# EAGLE schematic vga_controller (EAGLE 9.6.2)
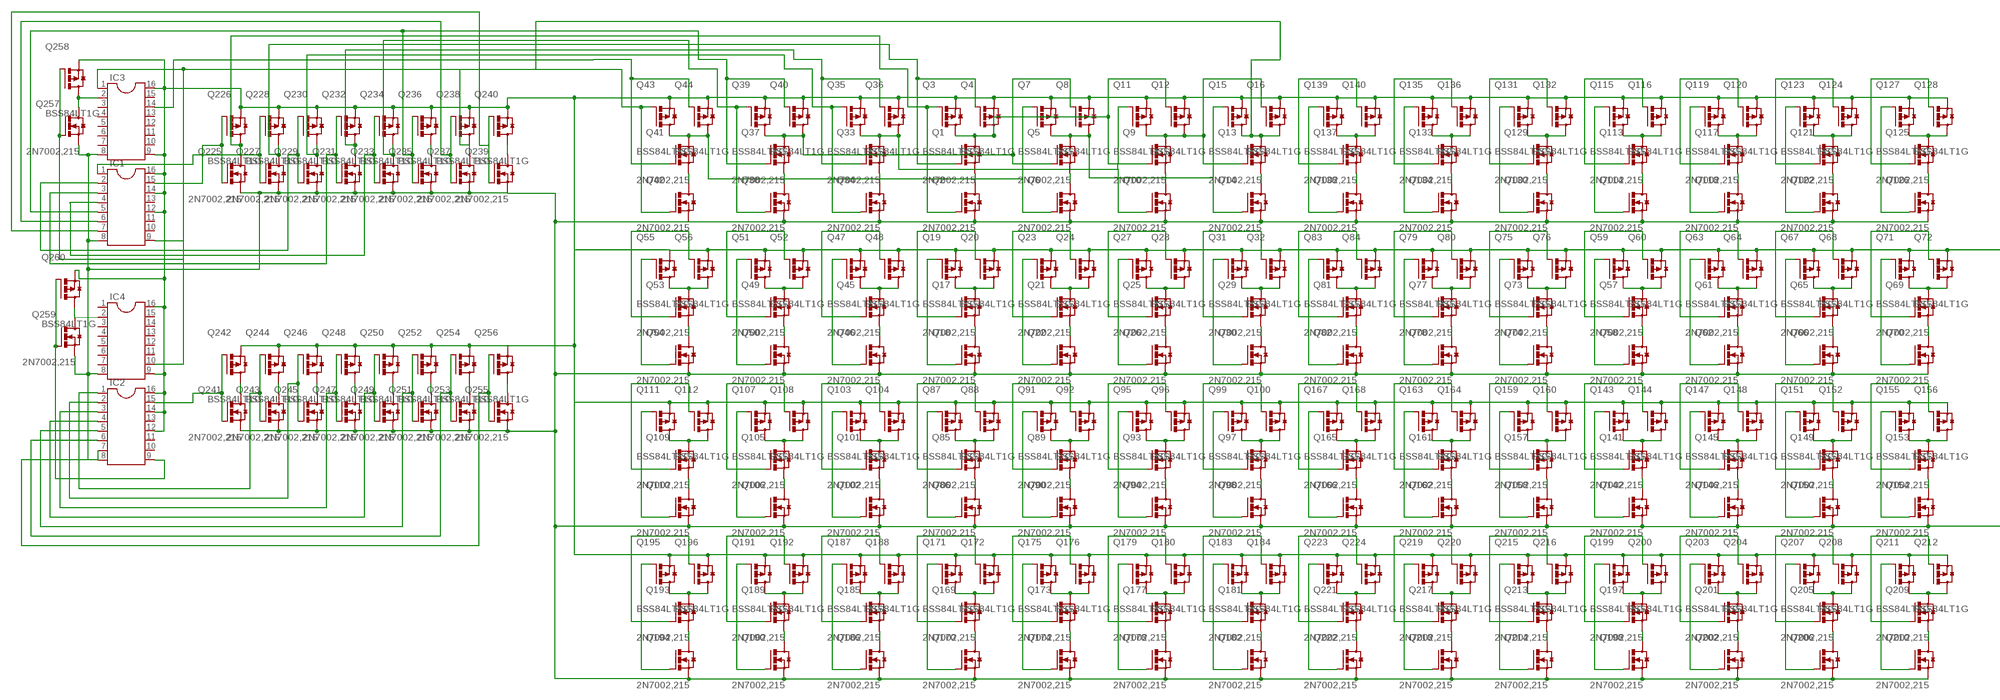
[diagram p0: schematic, sheet 1, part 1 of 2]
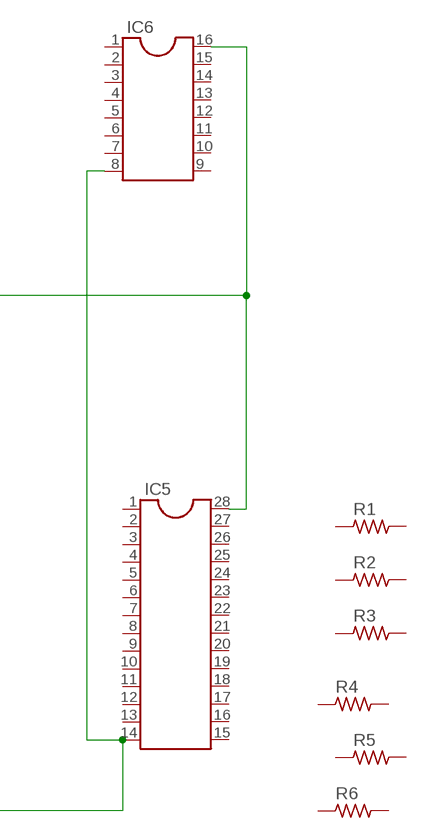
[diagram p1: schematic, sheet 1, part 2 of 2]

## Parts
IC1  DIL16S  [SOCKET-16]
IC2  DIL16S  [SOCKET-16]
IC3  DIL16S  [SOCKET-16]
IC4  DIL16S  [SOCKET-16]
IC5  DIL28-3  [DIL28-3]
IC6  DIL16S  [SOCKET-16]
Q1  2N7002,215  [SOT23-3]
Q2  2N7002,215  [SOT23-3]
Q3  BSS84LT1G  [SOT23-3]
Q4  BSS84LT1G  [SOT23-3]
Q5  2N7002,215  [SOT23-3]
Q6  2N7002,215  [SOT23-3]
Q7  BSS84LT1G  [SOT23-3]
Q8  BSS84LT1G  [SOT23-3]
Q9  2N7002,215  [SOT23-3]
Q10  2N7002,215  [SOT23-3]
Q11  BSS84LT1G  [SOT23-3]
Q12  BSS84LT1G  [SOT23-3]
Q13  2N7002,215  [SOT23-3]
Q14  2N7002,215  [SOT23-3]
Q15  BSS84LT1G  [SOT23-3]
Q16  BSS84LT1G  [SOT23-3]
Q17  2N7002,215  [SOT23-3]
Q18  2N7002,215  [SOT23-3]
Q19  BSS84LT1G  [SOT23-3]
Q20  BSS84LT1G  [SOT23-3]
Q21  2N7002,215  [SOT23-3]
Q22  2N7002,215  [SOT23-3]
Q23  BSS84LT1G  [SOT23-3]
Q24  BSS84LT1G  [SOT23-3]
Q25  2N7002,215  [SOT23-3]
Q26  2N7002,215  [SOT23-3]
Q27  BSS84LT1G  [SOT23-3]
Q28  BSS84LT1G  [SOT23-3]
Q29  2N7002,215  [SOT23-3]
Q30  2N7002,215  [SOT23-3]
Q31  BSS84LT1G  [SOT23-3]
Q32  BSS84LT1G  [SOT23-3]
Q33  2N7002,215  [SOT23-3]
Q34  2N7002,215  [SOT23-3]
Q35  BSS84LT1G  [SOT23-3]
Q36  BSS84LT1G  [SOT23-3]
Q37  2N7002,215  [SOT23-3]
Q38  2N7002,215  [SOT23-3]
Q39  BSS84LT1G  [SOT23-3]
Q40  BSS84LT1G  [SOT23-3]
Q41  2N7002,215  [SOT23-3]
Q42  2N7002,215  [SOT23-3]
Q43  BSS84LT1G  [SOT23-3]
Q44  BSS84LT1G  [SOT23-3]
Q45  2N7002,215  [SOT23-3]
Q46  2N7002,215  [SOT23-3]
Q47  BSS84LT1G  [SOT23-3]
Q48  BSS84LT1G  [SOT23-3]
Q49  2N7002,215  [SOT23-3]
Q50  2N7002,215  [SOT23-3]
Q51  BSS84LT1G  [SOT23-3]
Q52  BSS84LT1G  [SOT23-3]
Q53  2N7002,215  [SOT23-3]
Q54  2N7002,215  [SOT23-3]
Q55  BSS84LT1G  [SOT23-3]
Q56  BSS84LT1G  [SOT23-3]
Q57  2N7002,215  [SOT23-3]
Q58  2N7002,215  [SOT23-3]
Q59  BSS84LT1G  [SOT23-3]
Q60  BSS84LT1G  [SOT23-3]
Q61  2N7002,215  [SOT23-3]
Q62  2N7002,215  [SOT23-3]
Q63  BSS84LT1G  [SOT23-3]
Q64  BSS84LT1G  [SOT23-3]
Q65  2N7002,215  [SOT23-3]
Q66  2N7002,215  [SOT23-3]
Q67  BSS84LT1G  [SOT23-3]
Q68  BSS84LT1G  [SOT23-3]
Q69  2N7002,215  [SOT23-3]
Q70  2N7002,215  [SOT23-3]
Q71  BSS84LT1G  [SOT23-3]
Q72  BSS84LT1G  [SOT23-3]
Q73  2N7002,215  [SOT23-3]
Q74  2N7002,215  [SOT23-3]
Q75  BSS84LT1G  [SOT23-3]
Q76  BSS84LT1G  [SOT23-3]
Q77  2N7002,215  [SOT23-3]
Q78  2N7002,215  [SOT23-3]
Q79  BSS84LT1G  [SOT23-3]
Q80  BSS84LT1G  [SOT23-3]
Q81  2N7002,215  [SOT23-3]
Q82  2N7002,215  [SOT23-3]
Q83  BSS84LT1G  [SOT23-3]
Q84  BSS84LT1G  [SOT23-3]
Q85  2N7002,215  [SOT23-3]
Q86  2N7002,215  [SOT23-3]
Q87  BSS84LT1G  [SOT23-3]
Q88  BSS84LT1G  [SOT23-3]
Q89  2N7002,215  [SOT23-3]
Q90  2N7002,215  [SOT23-3]
Q91  BSS84LT1G  [SOT23-3]
Q92  BSS84LT1G  [SOT23-3]
Q93  2N7002,215  [SOT23-3]
Q94  2N7002,215  [SOT23-3]
Q95  BSS84LT1G  [SOT23-3]
Q96  BSS84LT1G  [SOT23-3]
Q97  2N7002,215  [SOT23-3]
Q98  2N7002,215  [SOT23-3]
Q99  BSS84LT1G  [SOT23-3]
Q100  BSS84LT1G  [SOT23-3]
Q101  2N7002,215  [SOT23-3]
Q102  2N7002,215  [SOT23-3]
Q103  BSS84LT1G  [SOT23-3]
Q104  BSS84LT1G  [SOT23-3]
Q105  2N7002,215  [SOT23-3]
Q106  2N7002,215  [SOT23-3]
Q107  BSS84LT1G  [SOT23-3]
Q108  BSS84LT1G  [SOT23-3]
Q109  2N7002,215  [SOT23-3]
Q110  2N7002,215  [SOT23-3]
Q111  BSS84LT1G  [SOT23-3]
Q112  BSS84LT1G  [SOT23-3]
Q113  2N7002,215  [SOT23-3]
Q114  2N7002,215  [SOT23-3]
Q115  BSS84LT1G  [SOT23-3]
Q116  BSS84LT1G  [SOT23-3]
Q117  2N7002,215  [SOT23-3]
Q118  2N7002,215  [SOT23-3]
Q119  BSS84LT1G  [SOT23-3]
Q120  BSS84LT1G  [SOT23-3]
Q121  2N7002,215  [SOT23-3]
Q122  2N7002,215  [SOT23-3]
Q123  BSS84LT1G  [SOT23-3]
Q124  BSS84LT1G  [SOT23-3]
Q125  2N7002,215  [SOT23-3]
Q126  2N7002,215  [SOT23-3]
Q127  BSS84LT1G  [SOT23-3]
Q128  BSS84LT1G  [SOT23-3]
Q129  2N7002,215  [SOT23-3]
Q130  2N7002,215  [SOT23-3]
Q131  BSS84LT1G  [SOT23-3]
Q132  BSS84LT1G  [SOT23-3]
Q133  2N7002,215  [SOT23-3]
Q134  2N7002,215  [SOT23-3]
Q135  BSS84LT1G  [SOT23-3]
Q136  BSS84LT1G  [SOT23-3]
Q137  2N7002,215  [SOT23-3]
Q138  2N7002,215  [SOT23-3]
Q139  BSS84LT1G  [SOT23-3]
Q140  BSS84LT1G  [SOT23-3]
Q141  2N7002,215  [SOT23-3]
Q142  2N7002,215  [SOT23-3]
Q143  BSS84LT1G  [SOT23-3]
Q144  BSS84LT1G  [SOT23-3]
Q145  2N7002,215  [SOT23-3]
Q146  2N7002,215  [SOT23-3]
Q147  BSS84LT1G  [SOT23-3]
Q148  BSS84LT1G  [SOT23-3]
Q149  2N7002,215  [SOT23-3]
Q150  2N7002,215  [SOT23-3]
Q151  BSS84LT1G  [SOT23-3]
Q152  BSS84LT1G  [SOT23-3]
Q153  2N7002,215  [SOT23-3]
Q154  2N7002,215  [SOT23-3]
Q155  BSS84LT1G  [SOT23-3]
Q156  BSS84LT1G  [SOT23-3]
Q157  2N7002,215  [SOT23-3]
Q158  2N7002,215  [SOT23-3]
Q159  BSS84LT1G  [SOT23-3]
Q160  BSS84LT1G  [SOT23-3]
Q161  2N7002,215  [SOT23-3]
Q162  2N7002,215  [SOT23-3]
Q163  BSS84LT1G  [SOT23-3]
Q164  BSS84LT1G  [SOT23-3]
Q165  2N7002,215  [SOT23-3]
Q166  2N7002,215  [SOT23-3]
Q167  BSS84LT1G  [SOT23-3]
Q168  BSS84LT1G  [SOT23-3]
Q169  2N7002,215  [SOT23-3]
Q170  2N7002,215  [SOT23-3]
Q171  BSS84LT1G  [SOT23-3]
Q172  BSS84LT1G  [SOT23-3]
Q173  2N7002,215  [SOT23-3]
Q174  2N7002,215  [SOT23-3]
Q175  BSS84LT1G  [SOT23-3]
Q176  BSS84LT1G  [SOT23-3]
Q177  2N7002,215  [SOT23-3]
Q178  2N7002,215  [SOT23-3]
Q179  BSS84LT1G  [SOT23-3]
Q180  BSS84LT1G  [SOT23-3]
Q181  2N7002,215  [SOT23-3]
Q182  2N7002,215  [SOT23-3]
Q183  BSS84LT1G  [SOT23-3]
Q184  BSS84LT1G  [SOT23-3]
Q185  2N7002,215  [SOT23-3]
Q186  2N7002,215  [SOT23-3]
Q187  BSS84LT1G  [SOT23-3]
Q188  BSS84LT1G  [SOT23-3]
Q189  2N7002,215  [SOT23-3]
Q190  2N7002,215  [SOT23-3]
Q191  BSS84LT1G  [SOT23-3]
Q192  BSS84LT1G  [SOT23-3]
Q193  2N7002,215  [SOT23-3]
Q194  2N7002,215  [SOT23-3]
Q195  BSS84LT1G  [SOT23-3]
Q196  BSS84LT1G  [SOT23-3]
Q197  2N7002,215  [SOT23-3]
Q198  2N7002,215  [SOT23-3]
Q199  BSS84LT1G  [SOT23-3]
Q200  BSS84LT1G  [SOT23-3]
Q201  2N7002,215  [SOT23-3]
Q202  2N7002,215  [SOT23-3]
Q203  BSS84LT1G  [SOT23-3]
Q204  BSS84LT1G  [SOT23-3]
Q205  2N7002,215  [SOT23-3]
Q206  2N7002,215  [SOT23-3]
Q207  BSS84LT1G  [SOT23-3]
Q208  BSS84LT1G  [SOT23-3]
Q209  2N7002,215  [SOT23-3]
Q210  2N7002,215  [SOT23-3]
Q211  BSS84LT1G  [SOT23-3]
Q212  BSS84LT1G  [SOT23-3]
Q213  2N7002,215  [SOT23-3]
Q214  2N7002,215  [SOT23-3]
Q215  BSS84LT1G  [SOT23-3]
Q216  BSS84LT1G  [SOT23-3]
Q217  2N7002,215  [SOT23-3]
Q218  2N7002,215  [SOT23-3]
Q219  BSS84LT1G  [SOT23-3]
Q220  BSS84LT1G  [SOT23-3]
Q221  2N7002,215  [SOT23-3]
Q222  2N7002,215  [SOT23-3]
Q223  BSS84LT1G  [SOT23-3]
Q224  BSS84LT1G  [SOT23-3]
Q225  2N7002,215  [SOT23-3]
Q226  BSS84LT1G  [SOT23-3]
Q227  2N7002,215  [SOT23-3]
Q228  BSS84LT1G  [SOT23-3]
Q229  2N7002,215  [SOT23-3]
Q230  BSS84LT1G  [SOT23-3]
Q231  2N7002,215  [SOT23-3]
Q232  BSS84LT1G  [SOT23-3]
Q233  2N7002,215  [SOT23-3]
Q234  BSS84LT1G  [SOT23-3]
Q235  2N7002,215  [SOT23-3]
Q236  BSS84LT1G  [SOT23-3]
Q237  2N7002,215  [SOT23-3]
Q238  BSS84LT1G  [SOT23-3]
Q239  2N7002,215  [SOT23-3]
Q240  BSS84LT1G  [SOT23-3]
Q241  2N7002,215  [SOT23-3]
Q242  BSS84LT1G  [SOT23-3]
Q243  2N7002,215  [SOT23-3]
Q244  BSS84LT1G  [SOT23-3]
Q245  2N7002,215  [SOT23-3]
Q246  BSS84LT1G  [SOT23-3]
Q247  2N7002,215  [SOT23-3]
Q248  BSS84LT1G  [SOT23-3]
Q249  2N7002,215  [SOT23-3]
Q250  BSS84LT1G  [SOT23-3]
Q251  2N7002,215  [SOT23-3]
Q252  BSS84LT1G  [SOT23-3]
Q253  2N7002,215  [SOT23-3]
Q254  BSS84LT1G  [SOT23-3]
Q255  2N7002,215  [SOT23-3]
Q256  BSS84LT1G  [SOT23-3]
Q257  2N7002,215  [SOT23-3]
Q258  BSS84LT1G  [SOT23-3]
Q259  2N7002,215  [SOT23-3]
Q260  BSS84LT1G  [SOT23-3]
R1  RC-MASTER-SMD_R_0603MP  [RC-MASTER-SMD_R0603MP]
R2  RC-MASTER-SMD_R_0603MP  [RC-MASTER-SMD_R0603MP]
R3  RC-MASTER-SMD_R_0603MP  [RC-MASTER-SMD_R0603MP]
R4  RC-MASTER-SMD_R_0603MP  [RC-MASTER-SMD_R0603MP]
R5  RC-MASTER-SMD_R_0603MP  [RC-MASTER-SMD_R0603MP]
R6  RC-MASTER-SMD_R_0603MP  [RC-MASTER-SMD_R0603MP]

## Nets
N$1: Q1.3(D) Q3.3(D) Q4.3(D) Q9.1(G) Q12.1(G)
N$2: Q1.2(S) Q2.3(D)
N$3: Q17.3(D) Q19.3(D) Q20.3(D)
N$4: IC3.1 IC4.10 Q13.3(D) Q15.3(D) Q16.3(D)
N$5: Q17.2(S) Q18.3(D)
N$6: Q5.3(D) Q7.3(D) Q8.3(D) Q14.1(G) Q15.1(G)
N$7: Q5.2(S) Q6.3(D)
N$8: Q18.1(G) Q19.1(G)
N$10: IC1.12 IC1.14 IC1.16 IC2.12 IC2.14 IC2.16 IC3.9 IC3.16 IC4.9 IC4.16 IC5.28 IC6.16 Q3.2(S) Q4.2(S) Q7.2(S) Q8.2(S) Q11.2(S) Q12.2(S) Q15.2(S) Q16.2(S) Q19.2(S) Q20.2(S) Q23.2(S) Q24.2(S) Q27.2(S) Q28.2(S) Q31.2(S) Q32.2(S) Q35.2(S) Q36.2(S) Q39.2(S) Q40.2(S) Q43.2(S) Q44.2(S) Q47.2(S) Q48.2(S) Q51.2(S) Q52.2(S) Q55.2(S) Q56.2(S) Q59.2(S) Q60.2(S) Q63.2(S) Q64.2(S) Q67.2(S) Q68.2(S) Q71.2(S) Q72.2(S) Q75.2(S) Q76.2(S) Q79.2(S) Q80.2(S) Q83.2(S) Q84.2(S) Q87.2(S) Q88.2(S) Q91.2(S) Q92.2(S) Q95.2(S) Q96.2(S) Q99.2(S) Q100.2(S) Q103.2(S) Q104.2(S) Q107.2(S) Q108.2(S) Q111.2(S) Q112.2(S) Q115.2(S) Q116.2(S) Q119.2(S) Q120.2(S) Q123.2(S) Q124.2(S) Q127.2(S) Q128.2(S) Q131.2(S) Q132.2(S) Q135.2(S) Q136.2(S) Q139.2(S) Q140.2(S) Q143.2(S) Q144.2(S) Q147.2(S) Q148.2(S) Q151.2(S) Q152.2(S) Q155.2(S) Q156.2(S) Q159.2(S) Q160.2(S) Q163.2(S) Q164.2(S) Q167.2(S) Q168.2(S) Q171.2(S) Q172.2(S) Q175.2(S) Q176.2(S) Q179.2(S) Q180.2(S) Q183.2(S) Q184.2(S) Q187.2(S) Q188.2(S) Q191.2(S) Q192.2(S) Q195.2(S) Q196.2(S) Q199.2(S) Q200.2(S) Q203.2(S) Q204.2(S) Q207.2(S) Q208.2(S) Q211.2(S) Q212.2(S) Q215.2(S) Q216.2(S) Q219.2(S) Q220.2(S) Q223.2(S) Q224.2(S) Q226.2(S) Q228.2(S) Q230.2(S) Q232.2(S) Q234.2(S) Q236.2(S) Q238.2(S) Q240.2(S) Q242.2(S) Q244.2(S) Q246.2(S) Q248.2(S) Q250.2(S) Q252.2(S) Q254.2(S) Q256.2(S) Q258.2(S) Q260.2(S)
N$11: Q9.3(D) Q11.3(D) Q12.3(D) Q13.1(G) Q16.1(G)
N$12: Q9.2(S) Q10.3(D)
N$13: Q21.3(D) Q23.3(D) Q24.3(D)
N$15: Q10.1(G) Q11.1(G) Q33.3(D) Q35.3(D) Q36.3(D)
N$17: Q13.2(S) Q14.3(D)
N$18: Q21.2(S) Q22.3(D)
N$20: Q33.2(S) Q34.3(D)
N$21: Q22.1(G) Q23.1(G)
N$22: Q25.3(D) Q27.3(D) Q28.3(D)
N$23: Q25.2(S) Q26.3(D)
N$24: Q26.1(G) Q27.1(G)
N$25: Q29.3(D) Q31.3(D) Q32.3(D)
N$26: Q29.2(S) Q30.3(D)
N$27: Q30.1(G) Q31.1(G)
N$28: IC1.9 Q257.1(G) Q258.1(G)
N$29: Q45.3(D) Q47.3(D) Q48.3(D)
N$31: Q45.2(S) Q46.3(D)
N$32: Q46.1(G) Q47.1(G)
N$33: Q49.3(D) Q51.3(D) Q52.3(D)
N$34: Q49.2(S) Q50.3(D)
N$35: Q50.1(G) Q51.1(G)
N$36: Q53.3(D) Q55.3(D) Q56.3(D)
N$37: Q53.2(S) Q54.3(D)
N$38: Q54.1(G) Q55.1(G)
N$39: Q69.1(G) Q72.1(G)
N$40: Q5.1(G) Q8.1(G) Q37.3(D) Q39.3(D) Q40.3(D)
N$41: Q37.2(S) Q38.3(D)
N$42: Q57.3(D) Q59.3(D) Q60.3(D)
N$43: Q57.2(S) Q58.3(D)
N$44: Q58.1(G) Q59.1(G)
N$46: Q61.3(D) Q63.3(D) Q64.3(D)
N$47: Q6.1(G) Q7.1(G) Q41.3(D) Q43.3(D) Q44.3(D)
N$48: Q41.2(S) Q42.3(D)
N$49: Q61.2(S) Q62.3(D)
N$51: Q125.1(G) Q128.1(G)
N$52: Q62.1(G) Q63.1(G)
N$53: Q65.3(D) Q67.3(D) Q68.3(D)
N$54: Q65.2(S) Q66.3(D)
N$55: Q66.1(G) Q67.1(G)
N$56: Q69.3(D) Q71.3(D) Q72.3(D)
N$57: Q69.2(S) Q70.3(D)
N$58: IC1.8 IC2.7 IC2.8 IC3.8 IC4.8 IC5.14 IC6.8 Q2.2(S) Q6.2(S) Q10.2(S) Q14.2(S) Q18.2(S) Q22.2(S) Q26.2(S) Q30.2(S) Q34.2(S) Q38.2(S) Q42.2(S) Q46.2(S) Q50.2(S) Q54.2(S) Q58.2(S) Q62.2(S) Q66.2(S) Q70.2(S) Q74.2(S) Q78.2(S) Q82.2(S) Q86.2(S) Q90.2(S) Q94.2(S) Q98.2(S) Q102.2(S) Q106.2(S) Q110.2(S) Q114.2(S) Q118.2(S) Q122.2(S) Q126.2(S) Q130.2(S) Q134.2(S) Q138.2(S) Q142.2(S) Q146.2(S) Q150.2(S) Q154.2(S) Q158.2(S) Q162.2(S) Q166.2(S) Q170.2(S) Q174.2(S) Q178.2(S) Q182.2(S) Q186.2(S) Q190.2(S) Q194.2(S) Q198.2(S) Q202.2(S) Q206.2(S) Q210.2(S) Q214.2(S) Q218.2(S) Q222.2(S) Q225.2(S) Q227.2(S) Q229.2(S) Q231.2(S) Q233.2(S) Q235.2(S) Q237.2(S) Q239.2(S) Q241.2(S) Q243.2(S) Q245.2(S) Q247.2(S) Q249.2(S) Q251.2(S) Q253.2(S) Q255.1(G) Q255.2(S) Q256.1(G) Q257.2(S) Q259.2(S)
N$59: Q70.1(G) Q71.1(G)
N$60: Q73.3(D) Q75.3(D) Q76.3(D)
N$61: Q73.2(S) Q74.3(D)
N$62: Q74.1(G) Q75.1(G)
N$63: Q77.3(D) Q79.3(D) Q80.3(D)
N$64: Q77.2(S) Q78.3(D)
N$65: Q78.1(G) Q79.1(G)
N$66: Q81.3(D) Q83.3(D) Q84.3(D)
N$67: Q81.2(S) Q82.3(D)
N$68: Q82.1(G) Q83.1(G)
N$69: Q53.1(G) Q56.1(G)
N$70: Q49.1(G) Q52.1(G)
N$71: Q45.1(G) Q48.1(G)
N$72: Q17.1(G) Q20.1(G)
N$73: Q21.1(G) Q24.1(G)
N$74: Q25.1(G) Q28.1(G)
N$75: Q29.1(G) Q32.1(G)
N$76: Q81.1(G) Q84.1(G)
N$77: Q77.1(G) Q80.1(G)
N$78: Q73.1(G) Q76.1(G)
N$79: Q57.1(G) Q60.1(G)
N$80: Q61.1(G) Q64.1(G)
N$81: Q65.1(G) Q68.1(G)
N$82: Q85.3(D) Q87.3(D) Q88.3(D)
N$83: Q85.2(S) Q86.3(D)
N$84: Q86.1(G) Q87.1(G)
N$85: Q89.3(D) Q91.3(D) Q92.3(D)
N$86: Q89.2(S) Q90.3(D)
N$87: Q90.1(G) Q91.1(G)
N$88: Q93.3(D) Q95.3(D) Q96.3(D)
N$89: Q93.2(S) Q94.3(D)
N$90: Q94.1(G) Q95.1(G)
N$91: Q97.3(D) Q99.3(D) Q100.3(D)
N$92: Q97.2(S) Q98.3(D)
N$93: Q98.1(G) Q99.1(G)
N$94: IC2.9 Q259.1(G) Q260.1(G)
N$95: Q101.3(D) Q103.3(D) Q104.3(D)
N$96: Q101.2(S) Q102.3(D)
N$97: Q102.1(G) Q103.1(G)
N$98: Q105.3(D) Q107.3(D) Q108.3(D)
N$99: Q105.2(S) Q106.3(D)
N$100: Q106.1(G) Q107.1(G)
N$101: Q109.3(D) Q111.3(D) Q112.3(D)
N$102: Q109.2(S) Q110.3(D)
N$103: Q110.1(G) Q111.1(G)
N$104: Q153.1(G) Q156.1(G)
N$105: Q141.3(D) Q143.3(D) Q144.3(D)
N$106: Q141.2(S) Q142.3(D)
N$107: IC1.7 Q239.1(G) Q240.1(G)
N$108: Q142.1(G) Q143.1(G)
N$109: Q145.3(D) Q147.3(D) Q148.3(D)
N$110: Q145.2(S) Q146.3(D)
N$111: Q146.1(G) Q147.1(G)
N$112: Q149.3(D) Q151.3(D) Q152.3(D)
N$113: Q149.2(S) Q150.3(D)
N$114: Q150.1(G) Q151.1(G)
N$115: Q153.3(D) Q155.3(D) Q156.3(D)
N$116: Q153.2(S) Q154.3(D)
N$117: IC1.15 Q225.1(G) Q226.1(G)
N$118: Q154.1(G) Q155.1(G)
N$119: Q157.3(D) Q159.3(D) Q160.3(D)
N$120: Q157.2(S) Q158.3(D)
N$121: Q113.3(D) Q115.3(D) Q116.3(D)
N$122: Q113.2(S) Q114.3(D)
N$123: Q158.1(G) Q159.1(G)
N$124: Q114.1(G) Q115.1(G)
N$125: Q117.3(D) Q119.3(D) Q120.3(D)
N$126: Q117.2(S) Q118.3(D)
N$127: Q161.3(D) Q163.3(D) Q164.3(D)
N$128: Q118.1(G) Q119.1(G)
N$129: Q121.3(D) Q123.3(D) Q124.3(D)
N$130: Q121.2(S) Q122.3(D)
N$131: Q161.2(S) Q162.3(D)
N$132: Q122.1(G) Q123.1(G)
N$133: Q125.3(D) Q127.3(D) Q128.3(D)
N$134: Q125.2(S) Q126.3(D)
N$135: IC3.2 Q257.3(D) Q258.3(D)
N$136: Q126.1(G) Q127.1(G)
N$137: Q2.1(G) Q3.1(G) Q225.3(D) Q226.3(D)
N$138: Q129.3(D) Q131.3(D) Q132.3(D)
N$139: Q129.2(S) Q130.3(D)
N$140: Q162.1(G) Q163.1(G)
N$141: Q130.1(G) Q131.1(G)
N$142: Q133.3(D) Q135.3(D) Q136.3(D)
N$143: Q133.2(S) Q134.3(D)
N$144: Q165.3(D) Q167.3(D) Q168.3(D)
N$145: Q134.1(G) Q135.1(G)
N$146: Q137.3(D) Q139.3(D) Q140.3(D)
N$147: Q137.2(S) Q138.3(D)
N$148: Q165.2(S) Q166.3(D)
N$149: Q138.1(G) Q139.1(G)
N$150: IC1.1 Q227.1(G) Q228.1(G)
N$151: Q166.1(G) Q167.1(G)
N$152: Q109.1(G) Q112.1(G)
N$153: Q105.1(G) Q108.1(G)
N$154: Q101.1(G) Q104.1(G)
N$155: Q85.1(G) Q88.1(G)
N$156: Q89.1(G) Q92.1(G)
N$157: Q93.1(G) Q96.1(G)
N$158: Q97.1(G) Q100.1(G)
N$159: Q165.1(G) Q168.1(G)
N$160: Q161.1(G) Q164.1(G)
N$161: Q157.1(G) Q160.1(G)
N$162: Q141.1(G) Q144.1(G)
N$163: Q145.1(G) Q148.1(G)
N$164: Q149.1(G) Q152.1(G)
N$165: Q169.3(D) Q171.3(D) Q172.3(D)
N$166: Q169.2(S) Q170.3(D)
N$167: Q1.1(G) Q4.1(G) Q227.3(D) Q228.3(D)
N$168: Q170.1(G) Q171.1(G)
N$169: Q173.3(D) Q175.3(D) Q176.3(D)
N$170: Q173.2(S) Q174.3(D)
N$171: Q174.1(G) Q175.1(G)
N$172: Q177.3(D) Q179.3(D) Q180.3(D)
N$173: Q177.2(S) Q178.3(D)
N$174: Q178.1(G) Q179.1(G)
N$175: Q181.3(D) Q183.3(D) Q184.3(D)
N$176: Q181.2(S) Q182.3(D)
N$177: Q182.1(G) Q183.1(G)
N$179: Q185.3(D) Q187.3(D) Q188.3(D)
N$180: IC1.2 Q229.1(G) Q230.1(G)
N$181: Q185.2(S) Q186.3(D)
N$182: Q186.1(G) Q187.1(G)
N$183: Q189.3(D) Q191.3(D) Q192.3(D)
N$184: Q189.2(S) Q190.3(D)
N$185: Q190.1(G) Q191.1(G)
N$186: Q193.3(D) Q195.3(D) Q196.3(D)
N$187: Q193.2(S) Q194.3(D)
N$188: Q194.1(G) Q195.1(G)
N$189: Q209.1(G) Q212.1(G)
N$190: Q197.3(D) Q199.3(D) Q200.3(D)
N$191: Q197.2(S) Q198.3(D)
N$192: Q198.1(G) Q199.1(G)
N$193: Q201.3(D) Q203.3(D) Q204.3(D)
N$194: Q201.2(S) Q202.3(D)
N$195: Q202.1(G) Q203.1(G)
N$196: Q205.3(D) Q207.3(D) Q208.3(D)
N$197: Q34.1(G) Q35.1(G) Q229.3(D) Q230.3(D)
N$198: Q205.2(S) Q206.3(D)
N$199: Q206.1(G) Q207.1(G)
N$200: Q209.3(D) Q211.3(D) Q212.3(D)
N$201: Q209.2(S) Q210.3(D)
N$203: Q210.1(G) Q211.1(G)
N$204: Q213.3(D) Q215.3(D) Q216.3(D)
N$205: Q213.2(S) Q214.3(D)
N$206: Q214.1(G) Q215.1(G)
N$207: Q217.3(D) Q219.3(D) Q220.3(D)
N$208: Q217.2(S) Q218.3(D)
N$209: Q218.1(G) Q219.1(G)
N$210: IC1.3 Q231.1(G) Q232.1(G)
N$211: Q221.3(D) Q223.3(D) Q224.3(D)
N$212: Q221.2(S) Q222.3(D)
N$213: Q222.1(G) Q223.1(G)
N$214: Q193.1(G) Q196.1(G)
N$215: Q189.1(G) Q192.1(G)
N$216: Q185.1(G) Q188.1(G)
N$217: Q169.1(G) Q172.1(G)
N$218: Q173.1(G) Q176.1(G)
N$219: Q177.1(G) Q180.1(G)
N$220: Q181.1(G) Q184.1(G)
N$221: Q221.1(G) Q224.1(G)
N$222: Q217.1(G) Q220.1(G)
N$223: Q213.1(G) Q216.1(G)
N$224: Q197.1(G) Q200.1(G)
N$225: Q201.1(G) Q204.1(G)
N$226: Q205.1(G) Q208.1(G)
N$227: IC4.2 Q259.3(D) Q260.3(D)
N$229: IC1.6 Q237.1(G) Q238.1(G)
N$240: Q33.1(G) Q36.1(G) Q231.3(D) Q232.3(D)
N$241: IC1.4 Q233.1(G) Q234.1(G)
N$242: Q38.1(G) Q39.1(G) Q233.3(D) Q234.3(D)
N$243: IC1.5 Q37.1(G) Q40.1(G) Q235.1(G) Q236.1(G)
N$244: Q235.3(D) Q236.3(D)
N$246: Q42.1(G) Q43.1(G) Q237.3(D) Q238.3(D)
N$248: Q239.3(D) Q240.3(D)
N$251: IC2.15 Q241.1(G) Q242.1(G)
N$252: Q241.3(D) Q242.3(D)
N$253: IC2.1 Q243.1(G) Q244.1(G)
N$254: Q243.3(D) Q244.3(D)
N$255: IC2.2 Q245.1(G) Q246.1(G)
N$256: Q245.3(D) Q246.3(D)
N$257: IC2.3 Q247.1(G) Q248.1(G)
N$258: Q247.3(D) Q248.3(D)
N$259: IC2.4 Q249.1(G) Q250.1(G)
N$260: Q249.3(D) Q250.3(D)
N$261: IC2.5 Q251.1(G) Q252.1(G)
N$262: Q251.3(D) Q252.3(D)
N$263: IC2.6 Q253.1(G) Q254.1(G)
N$264: Q253.3(D) Q254.3(D)
N$266: Q255.3(D) Q256.3(D)
N$269: IC3.14 Q41.1(G) Q44.1(G)
N$276: Q137.1(G) Q140.1(G)
N$277: Q133.1(G) Q136.1(G)
N$278: Q129.1(G) Q132.1(G)
N$279: Q113.1(G) Q116.1(G)
N$280: Q117.1(G) Q120.1(G)
N$281: Q121.1(G) Q124.1(G)
Unconnected: IC1.10 IC1.11 IC1.13 IC2.10 IC2.11 IC2.13 IC3.3 IC3.4 IC3.5 IC3.6 IC3.7 IC3.10 IC3.11 IC3.12 IC3.13 IC3.15 IC4.1 IC4.3 IC4.4 IC4.5 IC4.6 IC4.7 IC4.11 IC4.12 IC4.13 IC4.14 IC4.15 IC5.1 IC5.2 IC5.3 IC5.4 IC5.5 IC5.6 IC5.7 IC5.8 IC5.9 IC5.10 IC5.11 IC5.12 IC5.13 IC5.15 IC5.16 IC5.17 IC5.18 IC5.19 IC5.20 IC5.21 IC5.22 IC5.23 IC5.24 IC5.25 IC5.26 IC5.27 IC6.1 IC6.2 IC6.3 IC6.4 IC6.5 IC6.6 IC6.7 IC6.9 IC6.10 IC6.11 IC6.12 IC6.13 IC6.14 IC6.15 R1.1 R1.2 R2.1 R2.2 R3.1 R3.2 R4.1 R4.2 R5.1 R5.2 R6.1 R6.2

## Library data of the parts
IC1-IC4 IC6 = ic-package:DIL16: Dual In Line / Socket
IC5 = ic-package:DIL28: Dual In Line
Q1 Q2 Q5 Q6 Q9 Q10 Q13 Q14 Q17 Q18 Q21 Q22 Q25 Q26 Q29 Q30 Q33 Q34 Q37 Q38 Q41 Q42 Q45 Q46 Q49 Q50 Q53 Q54 Q57 Q58 Q61 Q62 Q65 Q66 Q69 Q70 Q73 Q74 Q77 Q78 Q81 Q82 Q85 Q86 Q89 Q90 Q93 Q94 Q97 Q98 Q101 Q102 Q105 Q106 Q109 Q110 Q113 Q114 Q117 Q118 Q121 Q122 Q125 Q126 Q129 Q130 Q133 Q134 Q137 Q138 Q141 Q142 Q145 Q146 Q149 Q150 Q153 Q154 Q157 Q158 Q161 Q162 Q165 Q166 Q169 Q170 Q173 Q174 Q177 Q178 Q181 Q182 Q185 Q186 Q189 Q190 Q193 Q194 Q197 Q198 Q201 Q202 Q205 Q206 Q209 Q210 Q213 Q214 Q217 Q218 Q221 Q222 Q225 Q227 Q229 Q231 Q233 Q235 Q237 Q239 Q241 Q243 Q245 Q247 Q249 Q251 Q253 Q255 Q257 Q259 = Transistor:2N7002,215: MOSFET N-CH 60V 300MA SOT-23 Manufacturer's datasheet <https://assets.nexperia.com/documents/data-sheet/2N7002.pdf>; CREATED_BY: PCBLayout.com; DIGIKEY_PART_NUMBER: 1727-2764-1-ND; MANUFACTURER: Nexperia USA Inc.; MPN: 2N7002,215; PACKAGE: SOT-23-3
Q3 Q4 Q7 Q8 Q11 Q12 Q15 Q16 Q19 Q20 Q23 Q24 Q27 Q28 Q31 Q32 Q35 Q36 Q39 Q40 Q43 Q44 Q47 Q48 Q51 Q52 Q55 Q56 Q59 Q60 Q63 Q64 Q67 Q68 Q71 Q72 Q75 Q76 Q79 Q80 Q83 Q84 Q87 Q88 Q91 Q92 Q95 Q96 Q99 Q100 Q103 Q104 Q107 Q108 Q111 Q112 Q115 Q116 Q119 Q120 Q123 Q124 Q127 Q128 Q131 Q132 Q135 Q136 Q139 Q140 Q143 Q144 Q147 Q148 Q151 Q152 Q155 Q156 Q159 Q160 Q163 Q164 Q167 Q168 Q171 Q172 Q175 Q176 Q179 Q180 Q183 Q184 Q187 Q188 Q191 Q192 Q195 Q196 Q199 Q200 Q203 Q204 Q207 Q208 Q211 Q212 Q215 Q216 Q219 Q220 Q223 Q224 Q226 Q228 Q230 Q232 Q234 Q236 Q238 Q240 Q242 Q244 Q246 Q248 Q250 Q252 Q254 Q256 Q258 Q260 = Transistor:BSS84LT1G: MOSFET P-CH 50V 130MA SOT-23 Manufacturer's datasheet <https://www.onsemi.com/pub/Collateral/BSS84LT1-D.PDF>; CREATED_BY: PCBLayout.com; DIGIKEY_PART_NUMBER: BSS84LT1GOSCT-ND; MANUFACTURER: ON Semiconductor; MPN: BSS84LT1G; PACKAGE: SOT-23-3
R1-R6 = 52101-101-REV-A_v16:RC-MASTER-SMD_R_: RESISTOR